# Altium schematic sheet Sheet.SchDoc
size A4; SheetNumber: 1; SheetTotal: 1
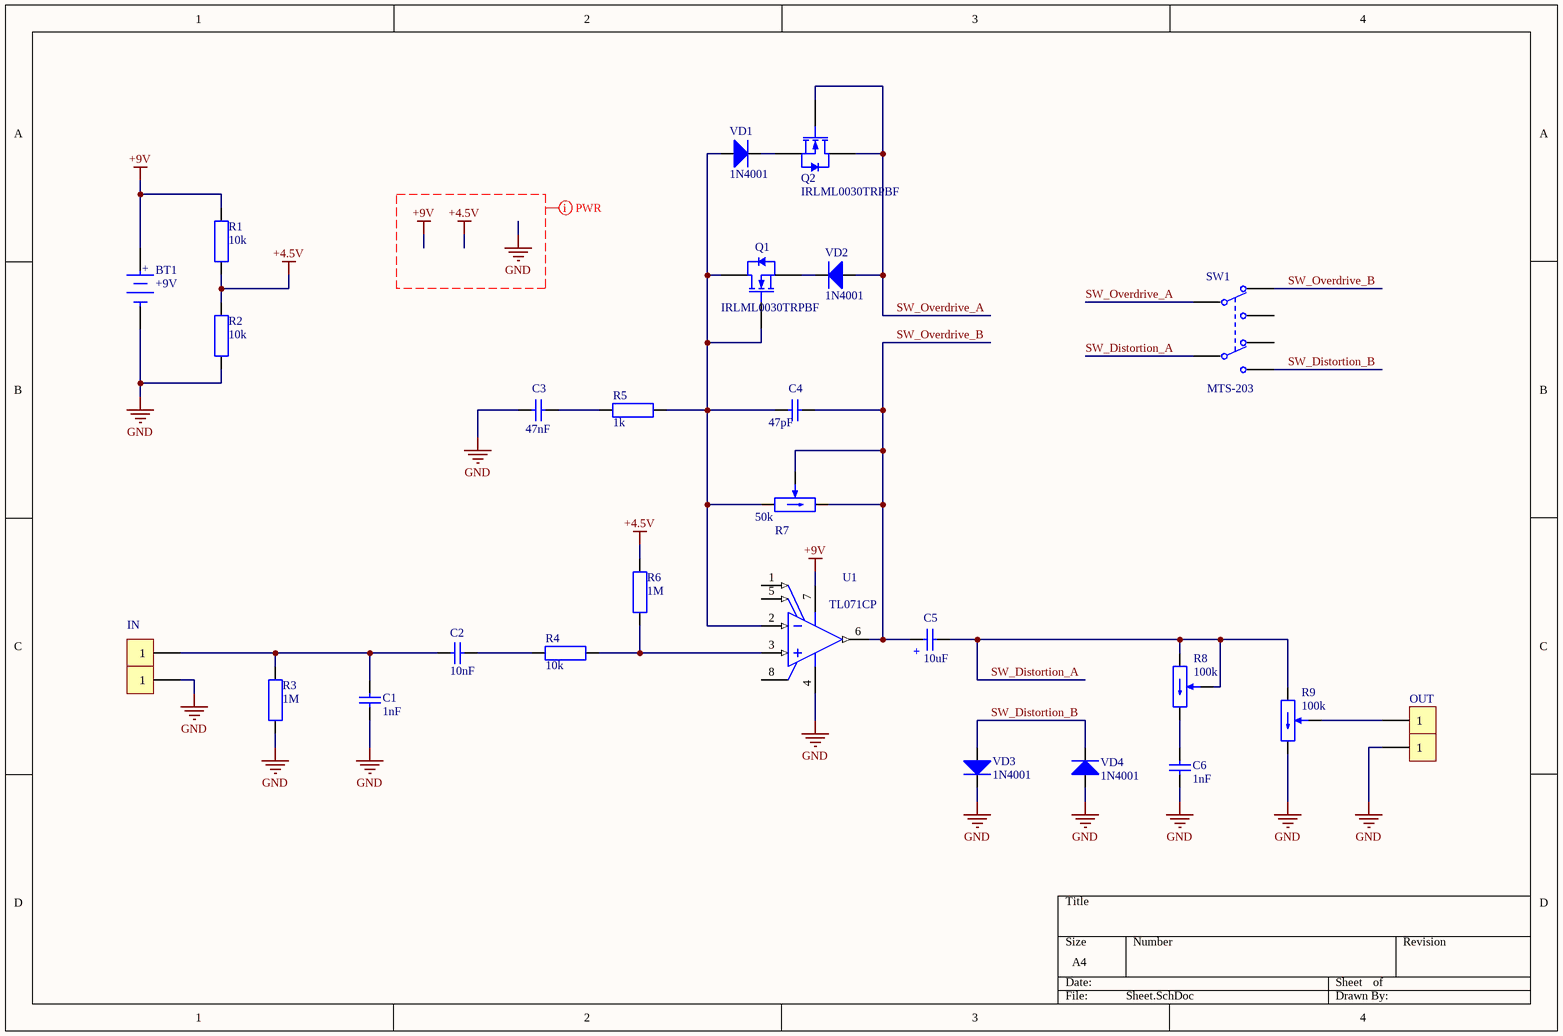
[diagram p0: Sheet.SchDoc]

## Parts
BT1  +9V  [Power socket Mirrored]
C1  1nF  [CAP-CER-DISK]
C2  10nF  [CAP-CER-DISK]
C3  47nF  [CAP-CER-DISK]
C4  47pF  [CAP-CER-DISK]
C5  10uF  [CAP-ELEC-5x11mm]
C6  1nF  [CAP-CER-DISK]
IN+  IN  [PLS-1]
IN-  PLS-1  [PLS-1]  (value not drawn)
OUT+  OUT  [PLS-1]
OUT-  OUT  [PLS-1]  (value not drawn)
Q1  IRLML0030TRPBF  [TO220 - HORIZONTAL]
Q2  IRLML0030TRPBF  [TO220 - HORIZONTAL]
R1  10k  [Res-Axis]
R2  10k  [Res-Axis]
R3  1M  [Res-Axis]
R4  10k  [Res-Axis]
R5  1k  [Res-Axis]
R6  1M  [Res-Axis]
R7  50k  [RES-POT-2]
R8  100k  [RES-POT-2]
R9  100k  [RES-POT-2]
SW1  MTS-203  [MTS-203]
U1  TL071CP  [DIP-8]
VD1  1N4001  [DIODE-AXIS]
VD2  1N4001  [DIODE-AXIS]
VD3  1N4001  [DIODE-AXIS]
VD4  1N4001  [DIODE-AXIS]

## Nets
+4.5V: R1.1 R2.2 R6.2
+9V: BT1.V(A) R1.2 U1.7(VCC+)
GND: BT1.G(C) C1.2 C3.1 C6.2 IN-.1 OUT-.1 R2.1 R3.1 R9.2(CW) U1.4(VCC-) VD3.C VD4.A
SW_Distortion_A: C5.C R8.1(CCW) R8.3(W) R9.1(CCW) SW1.5
SW_Distortion_B: SW1.6 VD3.A VD4.C
SW_Overdrive_A: Q2.1(G) Q2.2(D) SW1.2 VD2.A
SW_Overdrive_B: C4.2 C5.A R7.2(CW) R7.3(W) SW1.3 U1.6(OUT)
NetC1_1: C1.1 C2.2 IN+.1 R3.2
NetC2_1: C2.1 R4.1
NetC3_2: C3.2 R5.1
NetC4_1: C4.1 Q1.1(G) Q1.2(D) R5.2 R7.1(CCW) U1.2(IN-) VD1.A
NetC6_1: C6.1 R8.2(CW)
NetOUT+_1: OUT+.1 R9.3(W)
NetQ1_3: Q1.3(S) VD2.C
NetQ2_3: Q2.3(S) VD1.C
NetR4_2: R4.2 R6.1 U1.3(IN+)

Not connected (* = marked no-connect by the designer): SW1 1 4; U1 1(OFFSET_N1) 5(OFFSET_N2) 8(NC)

## Layout directives
net class PWR: +4.5V, +9V, GND

## Notes on the sheet
- (in symbol Battery) +
- (in symbol Cap_Polar) +

## Library data of the parts
BT1 = Battery
C1-C4 C6 = Cap
C5 = Cap_Polar
IN+ OUT+ OUT- = PLS-1
Q1 Q2 = MOSFET N-CH: Manufacturer: Infineon Technologies; Transistor Polarity: N-Channel; Код: 32; Part Number: IRLML0030TRPBF; Creation Date: 12.06.2019; Author: Tarasov Maxim
R1-R4 R6 = Res: Value: 1k
R5 = Res: Value: 1k
R7-R9 = Res_Pot
SW1 = MTS-203: DPDT
U1 = TL071CP: Low-Noise JFET-Input General-Purpose Operational Amplifier, 7 to 36 V, 0 to 70 degC, 8-pin DIP (P8), Pb-Free (RoHS); Manufacturer: Texas Instruments; Total Supply Voltage(Min)(+5V is 5, +/-5V is 10): 7; Iq per channel(Max)(mA): 2.5; GBW(Typ)(MHz): 3; Vio (25C)(Max)(mV): 10; CMRR(Min)(dB): 70; Rating: Military; Vn at 1kHz(Typ)(nV/rtHz): 18; IIB(Max)(pA): 200; Number of Channels: 1; Sub Family: General Purpose Amplifier, High Supply Voltage Amplifier (>=30V); Total Supply Voltage(Max)(+5V is 5, +/-5V is 10): 36; Slew Rate(Typ)(V/us): 13; ComponentLink1Description: Manufacturer URL; PackageReference: P0008A; ComponentLink3Description: Package Specification; ComponentLink3URL: http://www.ti.com/litv/pdf/mpdi001b; Mounting Technology: Through Hole; ComponentLink2Description: Datasheet; ComponentLink2URL: http://www.ti.com/lit/ds/symlink/tl071.pdf; PartNumber: TL071CP; Eco-Plan: Pb-Free (RoHS); Offset Drift(Typ)(uV/C): 18; Code_JEDEC: MS-001; DatasheetVersion: SLOS080J; PackageVersion: 4040082/E, 04/2010; PackageDescription: 8-Pin Plastic In-Line, Body 9.59 x 6.35 mm, Pitch 2.54 mm; ComponentLink1URL: http://www.ti.com/
VD1-VD4 = Diode